# EAGLE design esp32-hanover-flipdot (EAGLE 9.6.1)
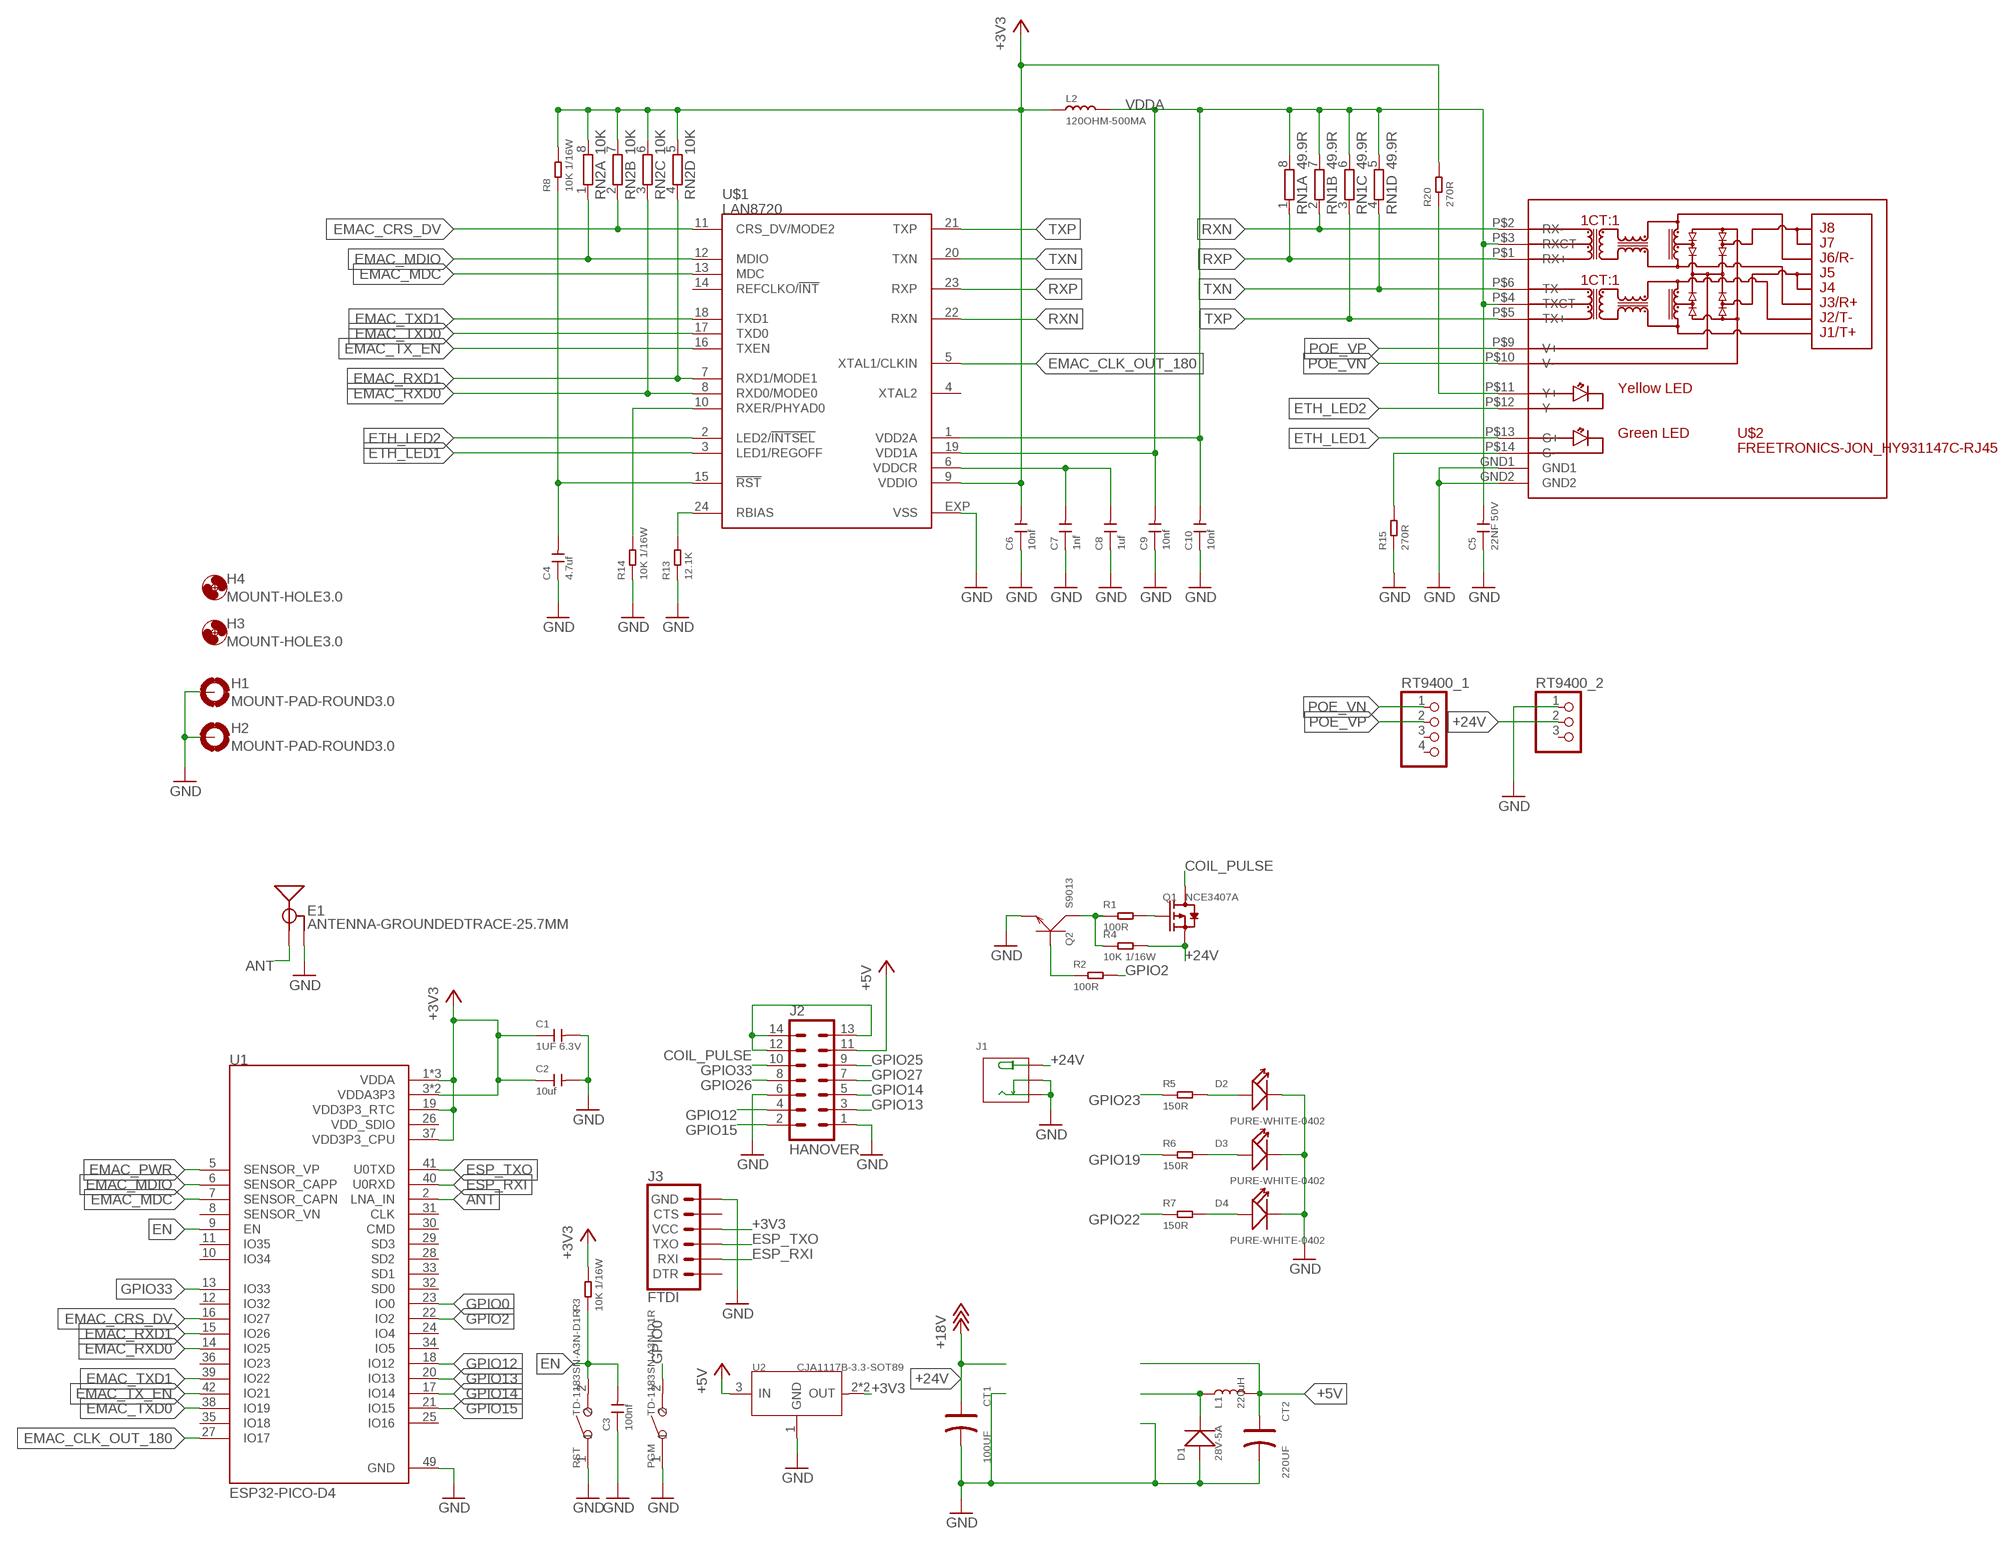
[diagram p0: schematic, sheet 1]

## Parts
C1  1UF 6.3V  CERAMIC-1UF-6.3V-10%-X5R(0402)  [C0402]
C2  10uf  CERAMIC-10UF-6.3V-20%-X5R(0402)  [C0402]
C3  100nf  CERAMIC-100NF-25V-10%-X7R(0402)  [C0402]
C4  4.7uf  CERAMIC-4.7UF-6.3V-20%-X5R(0402)  [C0402]
C5  22NF 50V  CERAMIC-22NF-50V-10%-X7R(0402)  [C0402]
C6  10nf  CERAMIC-10NF-50V-10%-X7R(0402)  [C0402]
C7  1nf  CERAMIC-1NF-50V-10%-X7R(0402)  [C0402]
C8  1uf  CERAMIC-1UF-10V-10%-X5R(0402)  [C0402]
C9  10nf  CERAMIC-10NF-50V-10%-X7R(0402)  [C0402]
C10  10nf  CERAMIC-10NF-50V-10%-X7R(0402)  [C0402]
CT1  100UF  ALUMINUM-SMD-220UF-16V(D6.3-H7.7MM)  [ELECTRO-SMD-C-6MM]
CT2  220UF  ALUMINUM-SMD-220UF-16V(D6.3-H7.7MM)  [ELECTRO-SMD-C-6MM]
D1  28V-5A  SMD-DIODE-SCHOTTKY-28V-5A(DO-214AA)  [DO-214AA]
D2  PURE-WHITE-0402  SMD-LED-YELLOW-DIFFUSED-PURE-WHITE(0402)  [LED-0402]
D3  PURE-WHITE-0402  SMD-LED-YELLOW-DIFFUSED-PURE-WHITE(0402)  [LED-0402]
D4  PURE-WHITE-0402  SMD-LED-YELLOW-DIFFUSED-PURE-WHITE(0402)  [LED-0402]
E1  ANTENNA-GROUNDEDTRACE-25.7MM  [TRACE_ANTENNA_2.4GHZ_25.7MM]
H1  MOUNT-PAD-ROUND3.0  [3,0-PAD]
H2  MOUNT-PAD-ROUND3.0  [3,0-PAD]
H3  MOUNT-HOLE3.0  [3,0]
H4  MOUNT-HOLE3.0  [3,0]
J1  DC-005  JACK-DC-005'DC-005'  [3P-L14.2*W11.0*H9.0MM]
J2  HANOVER  ML14  [ML14]
J3  FTDI  6_PIN_SERIAL_TARGETSILK  [6_PIN_SERIAL_TARGET_SIDE_W_SILK]
L1  220uH  INDUCTOR-CR54-3.3UH  [CR54]
L2  120OHM-500MA  SMD-FERRITE-CHIP-120-OHM-500MA(0603)  [L0603]
PGM  TD-1183SN-A3N-D1R  SMD-BUTTON(2P-3.0X2.5X1.2+0.4MM)-B3U-1000P-2P-SMD  [SW2-2.6-3.0X2.5X1.2+0.4MM]
Q1  NCE3407A  SMD-MOSFET-P-CH-VDC=30V-ID=4.3A-NCE3407A(SOT-23)  [SOT-23]
Q2  S9013  SMD-TRANSISTORS-NPN-25V-500MA-S9013(SOT-23)  [SOT-23]
R1  100R  SMD-RES-100R-5%-1/16W(0402)  [R0402]
R2  100R  SMD-RES-100R-5%-1/16W(0402)  [R0402]
R3  10K 1/16W  SMD-RES-10K-1%-1/16W(0402)  [R0402]
R4  10K 1/16W  SMD-RES-10K-1%-1/16W(0402)  [R0402]
R5  150R  SMD-RES-150R-1%-1/16W(0402)  [R0402]
R6  150R  SMD-RES-150R-1%-1/16W(0402)  [R0402]
R7  150R  SMD-RES-150R-1%-1/16W(0402)  [R0402]
R8  10K 1/16W  SMD-RES-10K-1%-1/16W(0402)  [R0402]
R13  12.1K  SMD-RES-12K-1%-1/16W(0402)  [R0402]
R14  10K 1/16W  SMD-RES-10K-1%-1/16W(0402)  [R0402]
R15  270R  SMD-RES-270R-1%-1/16W(0402)  [R0402]
R20  270R  SMD-RES-180R-1%-1/16W(0402)  [R0402]
RN1  49.9R  4R-NYC124  [YC124]
RN2  10K  4R-NYC124  [YC124]
RST  TD-1183SN-A3N-D1R  SMD-BUTTON(2P-3.0X2.5X1.2+0.4MM)-B3U-1000P-2P-SMD  [SW2-2.6-3.0X2.5X1.2+0.4MM]
RT9400_1  PINHD-1X4  [1X04]
RT9400_2  PINHD-1X3  [1X03]
U1  ESP32-PICO-D4  [PQFN50P700X700X104-49N]
U2  CJA1117B-3.3-SOT89  PMIC-CJA1117B-3.3(SOT-89)  [SOT-89]
U$1  LAN8720  [QFN24]
U$2  FREETRONICS-JON_HY931147C-RJ45  [FREETRONICS-JON_HY931147C]

## Nets
+3V3: C1.1 C2.1 C6.2 J3.P$4(VCC) L2.1 R3.2 R8.2 R20.2 RN2.5 RN2.6 RN2.7 RN2.8 U1.1(VDDA) U1.3(VDDA3P3) U1.4(VDDA3P3) U1.19(VDD3P3_RTC) U1.37(VDD3P3_CPU) U1.43(VDDA) U1.46(VDDA) U2.2(OUT) U2.4(OUT) U$1.9(VDDIO)
+5V [power]: CT2.+ J2.11 L1.P$2 U2.3(IN)
+24V: CT1.+ J1.+B(+) J1.+T(+) Q1.2(S) R4.2 RT9400_2.2 ; supply symbol labelled +18V
ANT: E1.ANT(SIGNAL) U1.2(LNA_IN)
COIL_PULSE: J2.12 J2.13 J2.14 Q1.3(D)
EMAC_CLK_OUT_180: U1.27(IO17) U$1.5(XTAL1/CLKIN)
EMAC_CRS_DV: RN2.2 U1.16(IO27) U$1.11(CRS_DV/MODE2)
EMAC_MDC: U1.7(SENSOR_CAPN) U$1.13(MDC)
EMAC_MDIO: RN2.1 U1.6(SENSOR_CAPP) U$1.12(MDIO)
EMAC_PWR: U1.5(SENSOR_VP)
EMAC_RXD0: RN2.3 U1.14(IO25) U$1.8(RXD0/MODE0)
EMAC_RXD1: RN2.4 U1.15(IO26) U$1.7(RXD1/MODE1)
EMAC_TX_EN: U1.42(IO21) U$1.16(TXEN)
EMAC_TXD0: U1.38(IO19) U$1.17(TXD0)
EMAC_TXD1: U1.39(IO22) U$1.18(TXD1)
EN: C3.2 R3.1 RST.2 U1.9(EN)
ESP_RXI: J3.P$3(RXI) U1.40(U0RXD)
ESP_TXO: J3.P$2(TXO) U1.41(U0TXD)
ETH_LED1: U$1.3(LED1/REGOFF) U$2.P$13(G+)
ETH_LED2: U$1.2(LED2/!INTSEL) U$2.P$12(Y-)
GND: C1.2 C2.2 C3.1 C4.1 C5.1 C6.1 C7.1 C8.1 C9.1 C10.1 CT1.- CT2.- D1.+ D2.- D3.- D4.- E1.GND E1.GND2(GND) H1.B3,0(MOUNT) H2.B3,0(MOUNT) J1.-1B(-) J1.-1T(-) J1.-2B(CDN) J1.-2T(CDN) J2.1 J2.6 J3.P$6(GND) PGM.1 Q2.2(E) R13.1 R14.1 R15.1 RST.1 RT9400_2.1 U1.49(GND) U2.1(GND) U$1.EXP(VSS) U$2.GND1 U$2.GND2
GPIO0: PGM.2 U1.23(IO0)
GPIO2: R2.2 U1.22(IO2)
GPIO12: J2.4 U1.18(IO12)
GPIO13: J2.3 U1.20(IO13)
GPIO14: J2.5 U1.17(IO14)
GPIO15: J2.2 U1.21(IO15)
GPIO19: R6.1
GPIO22: R7.1
GPIO23: R5.1
GPIO25: J2.9
GPIO26: J2.8
GPIO27: J2.7
GPIO33: J2.10 U1.13(IO33)
N$1: Q1.1(G) R1.2
N$2: Q2.3(C) R1.1 R4.1
N$3: Q2.1(B) R2.1
N$4: D1.- L1.P$1
N$5: D2.+ R5.2
N$6: D3.+ R6.2
N$7: D4.+ R7.2
N$8: R14.2 U$1.10(RXER/PHYAD0)
N$9: R13.2 U$1.24(RBIAS)
N$10: R15.2 U$2.P$14(G-)
N$13: C7.2 C8.2 U$1.6(VDDCR)
N$14: R20.1 U$2.P$11(Y+)
N$16: C4.2 R8.1 U$1.15(!RST)
POE_VN: RT9400_1.1 U$2.P$10(V-)
POE_VP: RT9400_1.2 U$2.P$9(V+)
RXN: RN1.2 U$1.22(RXN) U$2.P$2(RX-)
RXP: RN1.1 U$1.23(RXP) U$2.P$1(RX+)
TXN: RN1.4 U$1.20(TXN) U$2.P$6(TX-)
TXP: RN1.3 U$1.21(TXP) U$2.P$5(TX+)
VDDA: C5.2 C9.2 C10.2 L2.2 RN1.5 RN1.6 RN1.7 RN1.8 U$1.1(VDD2A) U$1.19(VDD1A) U$2.P$3(RXCT) U$2.P$4(TXCT)
Unconnected: J3.P$1(DTR) J3.P$5(CTS) RT9400_1.3 RT9400_1.4 RT9400_2.3 U1.8(SENSOR_VN) U1.10(IO34) U1.11(IO35) U1.12(IO32) U1.24(IO4) U1.25(IO16) U1.28(SD2) U1.29(SD3) U1.30(CMD) U1.31(CLK) U1.32(SD0) U1.33(SD1) U1.34(IO5) U1.35(IO18) U1.36(IO23) U$1.4(XTAL2) U$1.14(REFCLKO/!INT)

## Power pins joined to a net without a drawn wire
VDD_SDIO: U1.26(VDD_SDIO)

## Library data of the parts
C1 = OPL_Capacitor:CERAMIC-1UF-6.3V-10%-X5R(0402): 302010003; MPN: CC0402KRX5R5BB105
C2 = OPL_Capacitor:CERAMIC-10UF-6.3V-20%-X5R(0402): 302010053; MPN: CC0402MRX5R5BB106
C3 = OPL_Capacitor:CERAMIC-100NF-25V-10%-X7R(0402): 302010024; MPN: CC0402KRX7R8BB104
C4 = OPL_Capacitor:CERAMIC-4.7UF-6.3V-20%-X5R(0402): 302010019; MPN: CC0402MRX5R5BB475
C5 = OPL_Capacitor:CERAMIC-22NF-50V-10%-X7R(0402): 302010242; MPN: CC0402KRX7R9BB223
C6 C9 C10 = OPL_Capacitor:CERAMIC-10NF-50V-10%-X7R(0402): 302010006; MPN: CC0402KRX7R9BB103
C7 = OPL_Capacitor:CERAMIC-1NF-50V-10%-X7R(0402): 302010005; MPN: CC0402KRX7R9BB102
C8 = OPL_Capacitor:CERAMIC-1UF-10V-10%-X5R(0402): 302010040; MPN: CC0402KRX5R6BB105
CT1 = OPL_Capacitor:ALUMINUM-SMD-220UF-16V(D6.3-H7.7MM): 302030053; MPN: 302030000; VALUE: 220UF
CT2 = OPL_Capacitor:ALUMINUM-SMD-220UF-16V(D6.3-H7.7MM): 302030053; MPN: CS1E221M-CRE77
D1 = OPL_Discrete_Semiconductor:SMD-DIODE-SCHOTTKY-28V-5A(DO-214AA): 304020021; MPN: SS54B
D2-D4 = OPL_Optoelectronics:SMD-LED-YELLOW-DIFFUSED-PURE-WHITE(0402): 304090016; MPN: 16-219A/T2D-AR2T1QY/3T
E1 = SparkFun-RF:ANTENNA-GROUNDED: Antenna w/ Ground Connection 2.4GHz antennae with signal and ground terminals. TRACE_ANTENNA_2.4GHZ_15.2MM - Meander Trace antenna 15.2 x 5.7mm footprint Based on layout from TI app note AN043 <http://www.ti.com/lit/an/swra117d/swra117d.pdf>. TRACE_ANTENNA_2.4GHZ_25.7MM - Inverted F trace antenna 25.7 x 7.5 mm footprint. Based on layout from TI design note DN0007 <http://www.ti.com/lit/an/swru120b/swru120b.pdf>.
H1 H2 = holes:MOUNT-PAD-ROUND: MOUNTING PAD, round
H3 H4 = holes:MOUNT-HOLE: MOUNTING HOLE with drill center marker
J1 = OPL_Connector_DC-005_No_Polarity_Markings:JACK-DC-005: Seeed SKU 320120003 - DIP Black DC Jack 2.1MM MPN: DC-005 Important Notes: This part requires milling slots. Please make sure layer 46 Milling is included in the profile or outline layer when exporting Gerber files. Alternatively, you can use the built-in Seeed Fusion CAM file. Find it under Third-Party CAM files. Seeed Fusion PCBA OPL <https://www.seeedstudio.com/opl.html> Order PCB/PCBA Now <https://www.seeedstudio.com/fusion_pcb.html> www.seeedstudio.com
J2 = con-harting-ml:ML14: HARTING; OC_FARNELL: unknown; OC_NEWARK: unknown
J3 = SparkFun-Connectors:6_PIN_SERIAL_TARGET: 6-pin header connection for use with the "FTDI BASIC" pinout - TARGET SIDE. Also known as "Arduino Serial Program Header". It is used to mate with our FTDI Basic serial programmers using the Arduino IDE. Note, this device has "TARGET" in the name. It is intended to be used on a design that contains a target micro-controller that you wish to program. The "sister" device, named "CABLE" is inteneded to be used on a design that usually lives on the end of your USB cable and prvides the converter chip (FTDI232 or FTDI231x) to commnicate serial RX/TX. You can populate with some of these: Break Away Headers - Straight <https://www.sparkfun.com/products/116> (PRT-00116) For reference (or to suit your programming needs) check out these designs: SparkFun FTDI Basic Breakout - 5V <https://www.sparkfun.com/products/9716> (DEV-09716) SparkFun FTDI Basic Breakout - 3.3V <https://www.sparkfun.com/products/9873> (DEV-09873) SparkFun FTDI SmartBasic <https://www.sparkfun.com/products/12935> (DEV-12935) SparkFun Beefy 3 - FTDI Basic Breakout <https://www.sparkfun.com/products/13746> (DEV-13746)
L1 = SparkFun-Coils:INDUCTOR: Inductors Resist changes in electrical current. Basically a coil of wire. SparkFun Products: SparkFun Load Cell Amplifier - HX711 <https://www.sparkfun.com/products/13879> IOIO-OTG - V2.2 <https://www.sparkfun.com/products/13613>; PROD_ID: NDUC-11157; VALUE: 3.3µH/±30%/3.4A
L2 = OPL_Ferrite_and_Magnetic_Bead:SMD-FERRITE-CHIP-120-OHM-500MA(0603): 303030001; MPN: BLM18AG121SN1D
PGM RST = OPL_Switch:SMD-BUTTON(2P-3.0X2.5X1.2+0.4MM): 311020047; MPN: B3U-1000P-2P-SMD; VALUE: B3U-1000P-2P-SMD
Q1 = OPL_Discrete_Semiconductor:SMD-MOSFET-P-CH-VDC=30V-ID=4.3A-NCE3407A(SOT-23): 305030010; MPN: NCE3407A
Q2 = OPL_Discrete_Semiconductor:SMD-TRANSISTORS-NPN-25V-500MA-S9013(SOT-23): 305010018; MPN: S9013
R1 R2 = OPL_Resistor:SMD-RES-100R-5%-1/16W(0402): 301012008; MPN: RC0402JR-07100RL
R3 R4 R8 R14 = OPL_Resistor:SMD-RES-10K-1%-1/16W(0402): 301010047; MPN: RC0402FR-0710KL
R5-R7 = OPL_Resistor:SMD-RES-150R-1%-1/16W(0402): 301011984; MPN: RC0402FR-07150RL; VALUE: 0R
R13 = OPL_Resistor:SMD-RES-12K-1%-1/16W(0402): 301011982; MPN: RC0402JR-070RL; VALUE: 0R
R15 = OPL_Resistor:SMD-RES-270R-1%-1/16W(0402): 301011992; MPN: RC0402JR-070RL; VALUE: 0R
R20 = OPL_Resistor:SMD-RES-180R-1%-1/16W(0402): 301011986; MPN: RC0402JR-070RL; VALUE: 0R
RN1 = resistor-dil:4R-N: Array Chip Resistor Source: RS Component / Phycomp; MF: Yageo; MPN: YC124-FR-0749R9L; OC_FARNELL: unknown; OC_NEWARK: unknown
RN2 = resistor-dil:4R-N: Array Chip Resistor Source: RS Component / Phycomp; MF: Yageo; MPN: YC124-FR-0710KL; OC_FARNELL: unknown; OC_NEWARK: unknown
RT9400_1 = pinhead:PINHD-1X4: PIN HEADER
RT9400_2 = pinhead:PINHD-1X3: PIN HEADER
U1 = ESP32-PICO-D4:ESP32-PICO-D4: The ESP32-PICO-D4 is a System-in-Package (SIP) module that is based on ESP32, providing complete Wi-Fi and Bluetooth functionalities. The module has a size as small as 7.0±0.1 mm×7.0±0.1 mm×0.94±0.1 mm, thus requiring minimal PCB area. The module integrates a 4-MB SPI flash; DESCRIPTION: WIFi/Bluetooth SIP; MF: Espressif Systems; MP: ESP32-PICO-D4; PACKAGE: SMD-48 Espressif Systems
U2 = OPL_IC:PMIC-CJA1117B-3.3(SOT-89): 310030095; MPN: CJA1117B-3.3
U$1 = microchip-smsc-lan8720:LAN8720: LAN8720A/LAN8720Ai Small Footprint RMII 10/100 Ethernet PHY Transceiver with HP Auto-MDIX Support from SMSC / Microchip <http://www.microchip.com>. (C) 2014 Tomasz Boleslaw CEDRO, cederom@tlen.pl, http://www.tomek.cedro.info. Version 0.1 (2014-01-04): Initial release.
U$2 = parts:FREETRONICS-JON_HY931147C

## Net classes
0 default: width 0.152 mm, drill 0.305 mm
1 power: width 0.305 mm, drill 0.305 mm

## Board
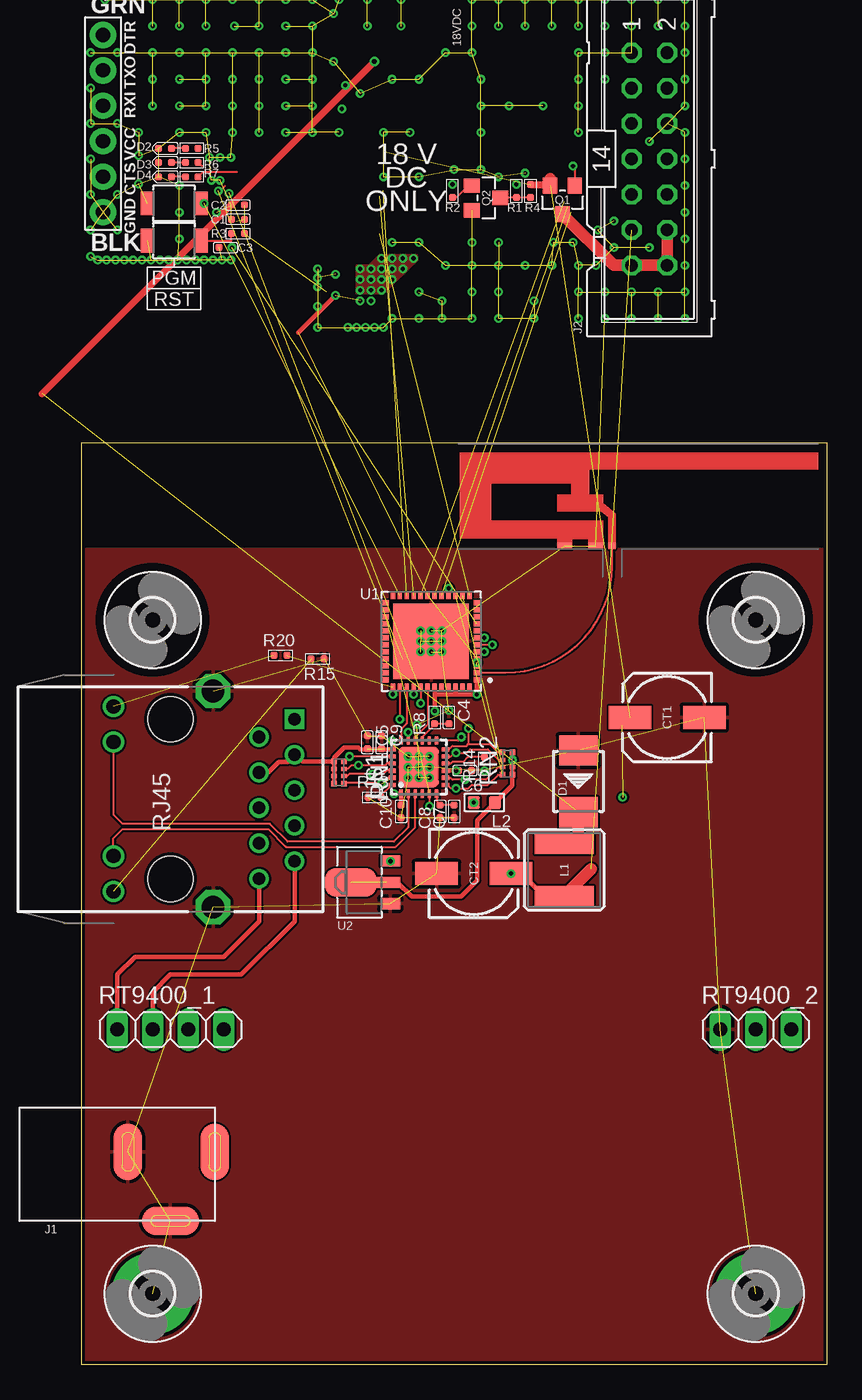
[diagram p1: board, top side]
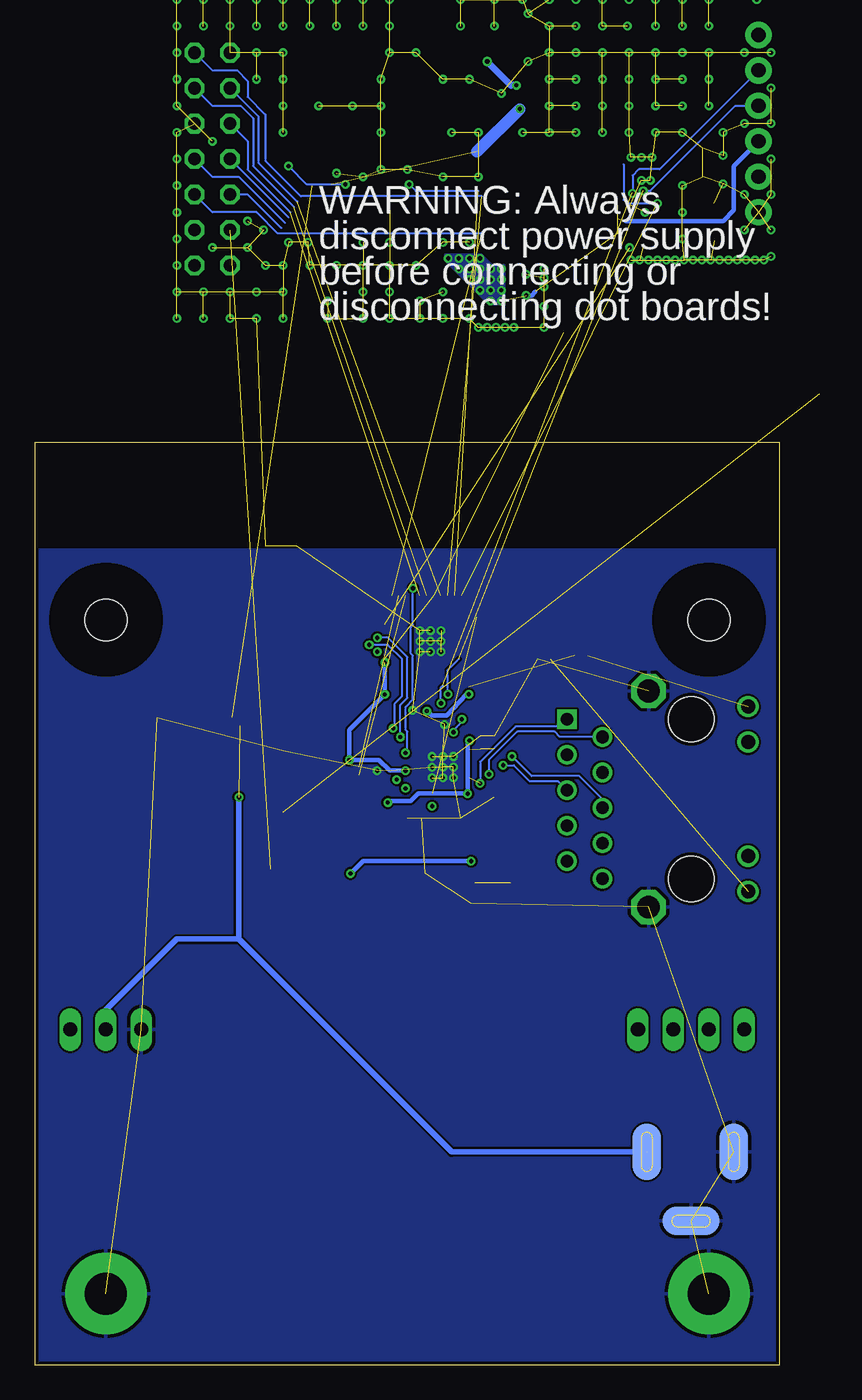
[diagram p2: board, bottom side, seen from below]

Size 53.34 x 66.04 mm. Coordinates in mm from the lower left corner, seen from the top.
Outline: 0,0 0,66.04 53.34,66.04 53.34,0 0,0
Copper layers (1*16): Top 0.035mm / dielectric 1.5mm / Bottom 0.035mm
Design rules "SeeedStudio_2layer_DRU_no_angle_20140221 *": minimum track width 6mil, minimum drill 12mil, track to track 6mil, track to pad 6mil, pad to pad 6mil, via to via 6mil, smd to smd 0mil, copper to edge 10mil, drill to drill 10mil, minimum pad ring 10mil, minimum via ring 6mil, stop-mask expansion 2mil, vias tented up to drill 100mil, thermal gap 10mil

### Footprints (pad centres in the part's own frame; a part is rotated, then mirrored left to right if it is on the bottom)
C0402 = smd 0.5 x 0.5: 1 0,0.463; 2 0,-0.463
ELECTRO-SMD-C-6MM = smd 3.048 x 1.651: + 2.667,0; - -2.667,0
DO-214AA = smd 2.159 x 2.743: + -2.21,0; - 2.21,0
LED-0402 = smd 0.5 x 0.5: + -0.463,0; - 0.463,0
TRACE_ANTENNA_2.4GHZ_25.7MM = smd 0.46 x 0.46: ANT 0,0.23 | smd 1 x 0.46: GND -1.18,0.23; GND2 -3.38,0.23
3,0-PAD = drill 3 pad 5.842: B3,0 0,0
3,0 = hole 3: 0,0
3P-L14.2*W11.0*H9.0MM = smd 2.032 x 4.064 bottom: +B 3.175,0; -1B -3.048,0 | smd 2.032 x 4.064: +T 3.175,0; -1T -3.048,0 | smd 4.064 x 2.032 bottom: -2B 0,-4.953 | smd 4.064 x 2.032: -2T 0,-4.953
ML14 = drill 0.914 octagon: 1 -7.62,-1.27; 2 -7.62,1.27; 3 -5.08,-1.27; 4 -5.08,1.27; 5 -2.54,-1.27; 6 -2.54,1.27; 7 0,-1.27; 8 0,1.27; 9 2.54,-1.27; 10 2.54,1.27; 11 5.08,-1.27; 12 5.08,1.27; 13 7.62,-1.27; 14 7.62,1.27
6_PIN_SERIAL_TARGET_SIDE_W_SILK = drill 1.016 pad 1.88: P$1 -6.35,0; P$2 -3.81,0; P$3 -1.27,0; P$4 1.27,0; P$5 3.81,0; P$6 6.35,0
CR54 = smd 4.2 x 1.4: P$1 0,1.85; P$2 0,-1.85
L0603 = smd 0.889 x 0.889: 1 -0.762,0; 2 0.762,0
SW2-2.6-3.0X2.5X1.2+0.4MM = smd 1 x 1.7: 1 -1.9,0; 2 1.9,0
SOT-23 = smd 1.016 x 1.143: 1 -0.889,-1.016; 2 0.889,-1.016; 3 0,1.016
R0402 = smd 0.5 x 0.5: 1 0,0.463; 2 0,-0.463
YC124 = smd 0.4 x 0.4: 1 -0.8,-0.35; 4 0.8,-0.35; 5 0.8,0.35; 8 -0.8,0.35 | smd 0.3 x 0.4: 2 -0.25,-0.35; 3 0.25,-0.35; 6 0.25,0.35; 7 -0.25,0.35
1X04 = drill 1.016 long: 1 -3.81,0; 2 -1.27,0; 3 1.27,0; 4 3.81,0
1X03 = drill 1.016 long: 1 -2.54,0; 2 0,0; 3 2.54,0
PQFN50P700X700X104-49N = smd 0.45 x 0.35: 1 -3.265,2.75; 2 -3.265,2.25; 3 -3.265,1.75; 4 -3.265,1.25; 5 -3.265,0.75; 6 -3.265,0.25; 7 -3.265,-0.25; 8 -3.265,-0.75; 9 -3.265,-1.25; 10 -3.265,-1.75; 11 -3.265,-2.25; 12 -3.265,-2.75; 25 3.265,-2.75; 26 3.265,-2.25; 27 3.265,-1.75; 28 3.265,-1.25; 29 3.265,-0.75; 30 3.265,-0.25; 31 3.265,0.25; 32 3.265,0.75; 33 3.265,1.25; 34 3.265,1.75; 35 3.265,2.25; 36 3.265,2.75 | smd 0.35 x 0.45: 13 -2.75,-3.265; 14 -2.25,-3.265; 15 -1.75,-3.265; 16 -1.25,-3.265; 17 -0.75,-3.265; 18 -0.25,-3.265; 19 0.25,-3.265; 20 0.75,-3.265; 21 1.25,-3.265; 22 1.75,-3.265; 23 2.25,-3.265; 24 2.75,-3.265; 37 2.75,3.265; 38 2.25,3.265; 39 1.75,3.265; 40 1.25,3.265; 41 0.75,3.265; 42 0.25,3.265; 43 -0.25,3.265; 44 -0.75,3.265; 45 -1.25,3.265; 46 -1.75,3.265; 47 -2.25,3.265; 48 -2.75,3.265 | smd 5.4 x 5.4: 49 0,0
SOT-89 = smd 0.8 x 1.4: 1 -1.524,-1.905; 3 1.524,-1.905 | smd 0.8 x 1.9: 2 0,-1.651 | smd 2.032 x 3.65: 4 0,0.94
QFN24 = smd 0.6 x 0.3: 1 -1.905,1.27; 2 -1.905,0.762; 3 -1.905,0.254; 4 -1.905,-0.254; 5 -1.905,-0.762; 6 -1.905,-1.27; 13 1.905,-1.27; 14 1.905,-0.762; 15 1.905,-0.254; 16 1.905,0.254; 17 1.905,0.762; 18 1.905,1.27 | smd 0.3 x 0.6: 7 -1.27,-1.905; 8 -0.762,-1.905; 9 -0.254,-1.905; 10 0.254,-1.905; 11 0.762,-1.905; 12 1.27,-1.905; 19 1.27,1.905; 20 0.762,1.905; 21 0.254,1.905; 22 -0.254,1.905; 23 -0.762,1.905; 24 -1.27,1.905 | smd 2.9 x 2.9: EXP 0,0
FREETRONICS-JON_HY931147C = drill 1.63 octagon: GND1 3.05,7.745; GND2 3.05,-7.745 | drill 0.9 square: P$1 8.89,5.715 | drill 0.9: P$2 6.35,4.445; P$3 8.89,3.175; P$4 6.35,1.905; P$5 8.89,0.635; P$6 6.35,-0.635; P$7 8.89,-1.905; P$8 6.35,-3.175; P$9 8.89,-4.445; P$10 6.35,-5.715 | drill 1.016: P$11 -4.08,6.625; P$12 -4.08,4.085; P$13 -4.08,-4.085; P$14 -4.08,-6.625 | hole 3.25: 0,5.715; 0,-5.715

### Placement (x,y rotation side)
C1  11.18,82.04 270 top  (outside the outline)
C2  11.18,83.06 270 top  (outside the outline)
C3  10.29,80.01 90 top  (outside the outline)
C4  26.29,46.35 0 top
C5  20.45,44.58 0 top
C6  27.43,42.55 270 top
C7  26.67,39.62 180 top
C8  25.65,39.62 180 top
C9  21.46,44.58 0 top
C10  22.86,39.62 180 top
CT1  41.91,46.35 180 top
CT2  28.07,35.18 0 top
D1  35.56,41.78 270 top
D2  5.97,87.12 180 top  (outside the outline)
D3  5.97,86.11 180 top  (outside the outline)
D4  5.97,85.09 180 top  (outside the outline)
E1  37.97,58.42 0 top
H1  48.26,5.08 0 top
H2  5.08,5.08 0 top
H3  5.08,53.34 0 top
H4  48.26,53.34 0 top
J1  6.35,15.24 0 top
J2  40.64,86.36 270 top  (outside the outline)
J3  1.52,88.9 270 top  (outside the outline)
L1  34.54,35.43 0 top
L2  28.83,40.26 180 top
PGM  6.6,83.19 0 top  (outside the outline)
Q1  34.42,83.44 180 top  (outside the outline)
Q2  28.96,83.57 270 top  (outside the outline)
R1  31.11,84.07 180 top  (outside the outline)
R2  26.54,84.07 180 top  (outside the outline)
R3  11.18,81.03 90 top  (outside the outline)
R4  32.13,84.07 180 top  (outside the outline)
R5  7.87,87.12 270 top  (outside the outline)
R6  7.87,86.11 270 top  (outside the outline)
R7  7.87,85.09 270 top  (outside the outline)
R8  25.27,46.35 180 top
R13  20.95,40.64 90 top
R14  28.83,43.05 180 top
R15  16.89,50.55 270 top
R20  14.22,50.8 90 top
RN1  18.41,42.42 90 top
RN2  30.48,43.05 270 top
RST  6.6,80.52 0 top  (outside the outline)
RT9400_1  6.35,24 0 top
RT9400_2  48.26,24 0 top
U1  25.02,51.82 180 top
U2  20.19,34.54 90 top
U$1  24.13,42.8 90 top
U$2  6.35,40.51 0 top

### Tracks (layer width: path | path; a pad name or v marks a point on that pad's centre or on a via)
+3V3  (via drill 0.3)  (12 unrouted)
  Top 0.152: v26.8,42.55 C6.2 | R8.2
  Top 0.305: 15.49,73.91 v18.16,76.58 | U$1.9 v26.8,42.55 | RN2.8 RN2.7 RN2.6 RN2.5 30.83,41.5 L2.1 28.32,38.99 28.32,34.67 27.18,33.53 23.62,33.53 22.61,34.54 | U1.43 25.27,48.01 | 25.27,48.01 R8.2 | U1.37 v22.27,48.01 | U1.46 26.77,48.01 | 25.27,48.01 26.77,48.01 | 26.77,48.01 v28.28,48.01 U1.1 | U1.4 U1.3
  Top 0.406: U2.2 22.61,34.54
  Bottom 0.305: v18.16,76.58 17.78,76.58 17.5,76.86 | J3.P$4 3.3,85.85 3.3,82.68 4.06,81.91 11.05,81.91 | v26.8,42.55 27.94,42.55 28.7,43.31 v30.83,43.31 30.83,45.46 v28.28,48.01 v28.28,50.29 | v22.27,48.01 22.47,48.01 23.85,46.48 24.94,46.48 v25.28,46.82
  other vias: 19.94,78.49 19.94,76.96 20.7,78.49 21.46,78.49 22.23,78.49 22.23,79.25 21.46,79.25 22.23,77.72 21.46,77.72 20.7,77.72 19.94,77.72 20.7,76.96 21.46,76.96 19.94,76.2 20.7,76.2 22.99,79.25 23.75,79.25 22.99,78.49
  pour Top (isolate 0.152, no thermals): 19.68,76.71 19.68,78.74 20.57,78.74 21.34,79.5 24,79.5 24.01,79.11 21.59,76.71
  pour Bottom (isolate 0.152, no thermals): 19.68,75.95 19.68,78.74 20.57,78.74 21.34,79.5 24,79.5 24,79.12 20.83,75.95
+5V  (via drill 0.3)  (1 unrouted)
  Top 0.305: 30.86,35.05 31.62,35.05 33.09,33.58
  Top 0.406: CT2.+ 30.86,35.05 | 33.09,33.58 L1.P$2
  Top 0.813: 36.47,35.51 L1.P$2
  Bottom 0.305: U2.3 29.84,36.07 CT2.+
  other vias: 22.1,36.07 30.73,35.18
+24V  (via drill 0.3)  (4 unrouted)
  Top 0.406: CT1.+ 38.66,45.77
  Top 0.508: R4.2 33.53,84.54 Q1.2
  Top 0.813: 33.53,84.96 33.53,84.54
  Bottom 0.406: J1.+T 23.5,15.24 38.73,30.48 | 38.73,30.48 v38.73,40.64 | RT9400_2.2 48.26,25.4 43.18,30.48 38.73,30.48
  Bottom 0.813: 21.69,86.87 v18.62,89.94
ANT
  Top 0.152: U1.2 30.35,49.57 arc90 37.97,57.19 E1.ANT
COIL_PULSE
  Top 0.813: Q1.3 38.1,78.74 J2.13 J2.14 J2.12
EMAC_CLK_OUT_180  (via drill 0.3)  (1 unrouted)
  Top 0.152: U$1.5 v24.89,40
EMAC_CRS_DV  (via drill 0.3)
  Top 0.152: U$1.11 26.42,43.56 26.67,43.81 v26.8,43.81 27.56,43.81 27.81,44.07 29.08,44.07 29.85,43.3 RN2.2 | U1.16 v26.27,55.62
  Bottom 0.152: v26.8,43.81 26.67,43.94 26.67,45.34 26.8,45.47 26.8,47.12 26.27,47.64 26.27,50.78 26.42,50.93 26.42,52.83 26.27,52.98 v26.27,55.62
EMAC_MDC  (via drill 0.3)
  Top 0.152: v27.18,44.96 26.92,44.7 U$1.13 | U1.7 v28.82,52.07
  Bottom 0.152: v27.18,44.96 27.18,47.24 26.67,47.75 26.67,50.67 28.06,52.07 v28.82,52.07
EMAC_MDIO  (via drill 0.3)
  Top 0.152: U$1.12 26.28,44.07 26.54,44.32 27.56,44.32 27.69,44.45 | 27.69,44.45 29.21,44.45 29.81,43.85 RN2.1 | v27.69,45.59 27.69,44.45 | U1.6 v29.4,51.57
  Bottom 0.152: v27.69,45.59 27.56,45.72 27.56,47.37 27.05,47.88 27.05,50.55 28.07,51.56 28.32,51.56 28.32,51.57 v29.4,51.57
EMAC_PWR  (via drill 0.3)
  Top 0.152: U1.5 v28.82,51.07
EMAC_RXD0  (via drill 0.3)  (1 unrouted)
  Top 0.152: RN2.3 29.85,42.8 28.96,41.91 v27.43,41.91 26.54,41.91 26.42,42.04 U$1.8
EMAC_RXD1  (via drill 0.3)  (1 unrouted)
  Top 0.152: U$1.7 26.16,41.53 26.42,41.27 v26.8,41.27 27.69,41.27 27.94,41.53 29.08,41.53 29.81,42.25 RN2.4
EMAC_TX_EN
  Top 0.152: 23.88,44.76 U$1.16 23.88,44.96 24.77,45.85 U1.42
EMAC_TXD0  (via drill 0.3)
  Top 0.152: U1.38 v22.77,46.23 | U$1.17 v23.37,45.31
  Bottom 0.152: v23.37,45.31 23.37,45.43 22.77,46.03 v22.77,46.23
EMAC_TXD1
  Top 0.152: 23.24,48.52 U1.39 23.27,45.92 22.86,45.52 U$1.18
EN  (via drill 0.3)  (1 unrouted)
  Top 0.152: RST.2 10.71,80.52 | 10.71,80.52 R3.1 | C3.2 10.71,80.01 10.71,80.52
  other vias: 10.75,80.01
ESP_RXI  (via drill 0.3)  (1 unrouted)
  Top 0.152: 10.27,84.44 9.91,84.07 v9.78,84.07 | U1.40 v23.77,48.01
  Bottom 0.152: J3.P$3 3.17,90.17 9.27,84.07 v9.78,84.07 | v23.77,48.01 23.77,49.76 22.99,50.55
ESP_TXO  (via drill 0.3)  (1 unrouted)
  Top 0.152: 10.57,83.94 v10.54,83.9 | U1.41 v24.27,47.37
  Bottom 0.152: v10.54,83.9 10.54,85.17 10.09,85.62 8.61,85.62 J3.P$2 | v24.27,47.37 24.27,48.51 24.13,48.64
ETH_LED1
  Top 0.152: U$2.P$13 2.27,37.7 2.93,38.35 13.34,38.35 14.61,37.08 22.48,37.08 23.88,38.48 U$1.3
ETH_LED2
  Top 0.152: U$2.P$12 2.27,39.39 2.93,38.73 13.46,38.73 14.73,37.46 22.35,37.46 23.37,38.48 U$1.2
GND  (via drill 0.3)  (246 unrouted)
  other vias: 1.14,79.12 1.78,79.12 2.41,79.12 3.05,79.12 3.68,79.12 4.32,79.12 4.95,79.12 5.59,79.12 6.22,79.12 6.86,79.12 7.49,79.12 8.13,79.12 8.76,79.12 9.4,79.12 10.03,79.12 10.67,79.12 16.89,74.3 26.04,93.98 27.94,97.79 39.37,76.83 41.27,74.93 39.37,74.93 0.64,79.38 16.89,77.22 16.89,77.85 16.89,78.49 27.94,95.88 27.94,93.98 29.84,95.88 29.84,97.79 31.75,95.88 31.75,97.79 37.47,97.79 39.37,97.79 39.37,95.88 41.27,97.79 43.18,97.79 43.18,95.88 43.18,93.98 37.47,95.88 37.47,93.98 37.47,92.07 41.27,76.83 37.47,76.83 37.47,74.93 35.56,76.83 29.84,74.93 29.84,76.83 41.27,95.88 35.56,74.93 9.14,86.49 10.67,86.49 9.91,86.49 10.92,95.88 12.7,93.98 10.79,93.98 8.89,93.98 1.65,97.79 0.64,93.98 6.99,84.45 16.51,97.79 16.51,88.27 18.41,88.27 2.54,93.98 4.06,88.27 6.99,80.64 6.99,82.55 18.41,97.79 24.13,85.09 28.57,92.07 28.57,90.17 33.02,90.17 35.56,88.27 35.56,90.17 35.56,92.07 35.56,93.98 33.66,97.79 33.66,95.88 35.56,95.88 35.56,97.79 43.18,92.07 43.18,90.17 43.18,88.27 43.18,86.36 43.18,84.45 43.18,82.55 43.18,80.64 43.18,78.74 43.18,76.83 43.18,74.93 27.94,76.83 27.94,74.93 27.94,78.74 29.84,78.74 31.75,78.74 26.04,78.74 25.78,74.93 24.13,74.93 24.13,76.83 18.16,78.1 22.23,74.93 24.13,92.07 20.45,97.79 22.86,97.79 22.86,95.88 20.45,95.88 8.89,92.07 10.79,92.07 12.7,92.07 14.61,95.88 16.51,95.88 16.51,93.98 16.51,92.07 16.51,90.17 22.23,80.39 24.13,80.39 27.94,80.39 29.84,80.39 28.57,85.6 26.67,85.6 9.65,82.55 22.23,92.07 4.06,86.61 4.06,84.58 30.61,90.17 21.59,88.27 21.59,85.09 16.89,75.82 19.05,74.3 19.68,74.3 20.32,74.3 20.95,74.3 21.59,74.3 40.64,87.63 12.7,90.17 8.89,90.17 6.99,92.07 14.61,92.07 12.7,97.79 14.61,93.98 10.79,90.17 6.99,90.17 6.99,93.98 6.99,97.79 8.89,97.79 10.79,97.79 14.61,97.79 12.7,95.88 14.61,90.17 18.03,93.34 18.03,96.77 19.94,91.06 35.18,80.39 33.66,78.74 35.56,78.74 32.38,74.93 32.38,76.2 25.78,76.2 9.27,84.84 9.91,84.84 29.84,85.09 31.75,85.34 23.5,88.27 28.57,88.27 6.99,95.88 8.89,95.88 12.7,88.27 14.61,88.27 10.79,88.27 8.89,88.27 6.99,88.27 5.08,97.79 5.08,95.88 5.08,93.98 5.08,92.07 5.08,90.17 0.64,91.44 0.64,88.9 2.54,88.9 0.64,86.36 2.54,83.82 0.64,83.82 0.64,81.28 2.54,81.28 40.64,80.01 38.1,80.01 38.1,81.91 36.96,81.28 33.78,80.39 36.83,78.74 28.83,42.55 24.13,42.8 23.37,42.8 23.37,42.04 24.13,42.04 24.89,42.04 24.89,42.8 24.89,43.56 24.13,43.56 23.37,43.56 24,45.85 26.29,46.86 25.02,51.82 24.26,51.82 24.26,52.58 25.02,52.58 25.02,51.05 24.26,51.05 25.78,51.05 25.78,51.82 25.78,52.58
  pour Top (rank 6): 0,58.42 0,0 53.34,0 53.34,58.42
  pour Bottom (rank 6): 0,58.42 0,0 53.34,0 53.34,58.42
GPIO0  (via drill 0.3)  (1 unrouted)
  Top 0.152: v8.76,83.19 PGM.2
  Bottom 0.152: v8.76,83.19 10.92,83.19 11.18,83.44 11.18,85.98
GPIO2  (via drill 0.3)  (1 unrouted)
  Bottom 0.152: R2.2 26.08,84.07 21.59,84.07
  other vias: 26.54,84.54
GPIO12  (1 unrouted)
  Bottom 0.152: J2.4 40.64,90.17 38.61,90.17 37.72,89.28 37.72,85.85 34.8,82.94
GPIO13  (1 unrouted)
  Bottom 0.152: J2.3 37.34,89.41 37.34,86.11 34.54,83.31
GPIO14  (1 unrouted)
  Bottom 0.152: J2.5 38.1,87.63 38.1,85.6 35.05,82.55
GPIO15  (1 unrouted)
  Bottom 0.152: J2.2 40.64,92.71 38.86,92.71 38.1,91.95 38.1,90.8 36.83,89.53 36.83,86.23 34.29,83.69 21.34,83.69
GPIO19
  Top 0.152: R6.1 8.59,85.85
GPIO22
  Top 0.152: R7.1 8.67,85.42 11.1,85.42
GPIO25
  Bottom 0.152: 35.69,81.41 38.1,83.82 J2.9
GPIO26
  Bottom 0.152: J2.8 40.64,85.09 38.73,85.09 35.43,81.79
GPIO27
  Bottom 0.152: J2.7 35.18,82.17
GPIO33  (1 unrouted)
  Bottom 0.152: J2.10 40.64,82.55 37.47,82.55 35.94,81.03 21.34,81.03
N$1  (via drill 0.3)
  Top 0.152: v35.18,85.85 35.31,85.72 Q1.1
  Bottom 0.152: R1.2 33.86,84.54 v35.18,85.85
  other vias: 31.11,84.54
N$2
  Top 0.152: Q2.3 30.02,83.61 R1.1 R4.1
N$3
  Top 0.152: Q2.1 27.69,84.45 26.84,83.61 R2.1
N$4  (via drill 0.3, 0.35)  (1 unrouted)
  Top 0.508: v20.95,93.34 -2.85,69.54
  Top 0.813: 36.22,38.91 D1.- 35.56,37.28 L1.P$1
  Bottom 0.508: v18.87,91.64 19.25,91.64 v20.95,93.34
N$5
  Top 0.152: R5.2 D2.+
N$6
  Top 0.152: R6.2 D3.+
N$7
  Top 0.152: R7.2 D4.+
N$8
  Top 0.152: U$1.10 26.42,43.05 26.54,43.18 27.3,43.18 27.64,43.52 R14.2
N$9
  Top 0.152: U$1.24 22.18,41.53 21.42,40.77 R13.2
N$10  (1 unrouted)
N$13
  Top 0.152: C7.2 C8.2 25.65,40.13 25.4,40.39 U$1.6
N$14  (1 unrouted)
N$16
  Top 0.152: U$1.15 24.39,44.95 25.27,45.84 R8.1 C4.2
POE_VN
  Top 0.305: U$2.P$10 12.7,31.75 10.16,29.21 3.81,29.21 2.54,27.94 RT9400_1.1
POE_VP
  Top 0.305: U$2.P$9 15.24,31.75 11.43,27.94 6.35,27.94 5.08,26.67 RT9400_1.2
RXN  (via drill 0.3)
  Top 0.152: U$1.22 21.84,42.55 21.59,42.29 v20.83,42.29 19.14,42.29 19.02,42.17 RN1.2
  Bottom 0.152: U$2.P$2 15.75,44.96 16.13,45.34 18.8,45.34 20.83,43.31 v20.83,42.29
RXP  (via drill 0.3)  (1 unrouted)
  Top 0.152: U$1.23 21.84,42.04 21.46,41.66 18.8,41.66 RN1.1
  Bottom 0.152: U$2.P$1 15.49,46.23 16,45.72 18.92,45.72 21.46,43.18 v21.46,41.63
TXN  (via drill 0.3)
  Top 0.152: RN1.4 19.11,43.56 v19.18,43.56 U$1.20
  Bottom 0.152: U$2.P$6 12.7,40.51 14.35,42.16 17.78,42.16 v19.18,43.56
TXP  (via drill 0.3)
  Top 0.152: U$1.21 21.84,43.05 21.72,42.93 v19.81,42.93 19.3,42.93 19.05,42.67 RN1.3
  Bottom 0.152: U$2.P$5 15.88,41.78 17.91,41.78 19.05,42.93 v19.81,42.93
VDDA  (via drill 0.3)  (2 unrouted)
  Top 0.152: 19.94,44.07 19.81,44.2 | 15.37,43.69 U$2.P$3
  Top 0.305: 19.81,44.2 18.79,44.2 18.07,43.47 RN1.5 | 19.94,44.07 U$1.19 v22.23,44.7 | RN1.5 15.84,43.22 15.37,43.69 | U$2.P$3 14.73,43.18 14.1,43.18 13.34,42.42 U$2.P$4 | C10.2 U$1.1 v22.35,40.89 | RN1.8 RN1.7 RN1.6 RN1.5
  Bottom 0.152: v22.23,44.7 22.35,44.58
  Bottom 0.305: 22.35,44.58 v22.35,40.89 25.91,40.89 26.42,40.39 27.94,40.39 L2.2
  other vias: 28.07,40.26

### Text on the board
tNames: 18VDC | 18 V / DC / ONLY
bNames: WARNING: Always / disconnect power supply / before connecting or / disconnecting dot boards!